# Altium project IPM Circuit.PrjPcb
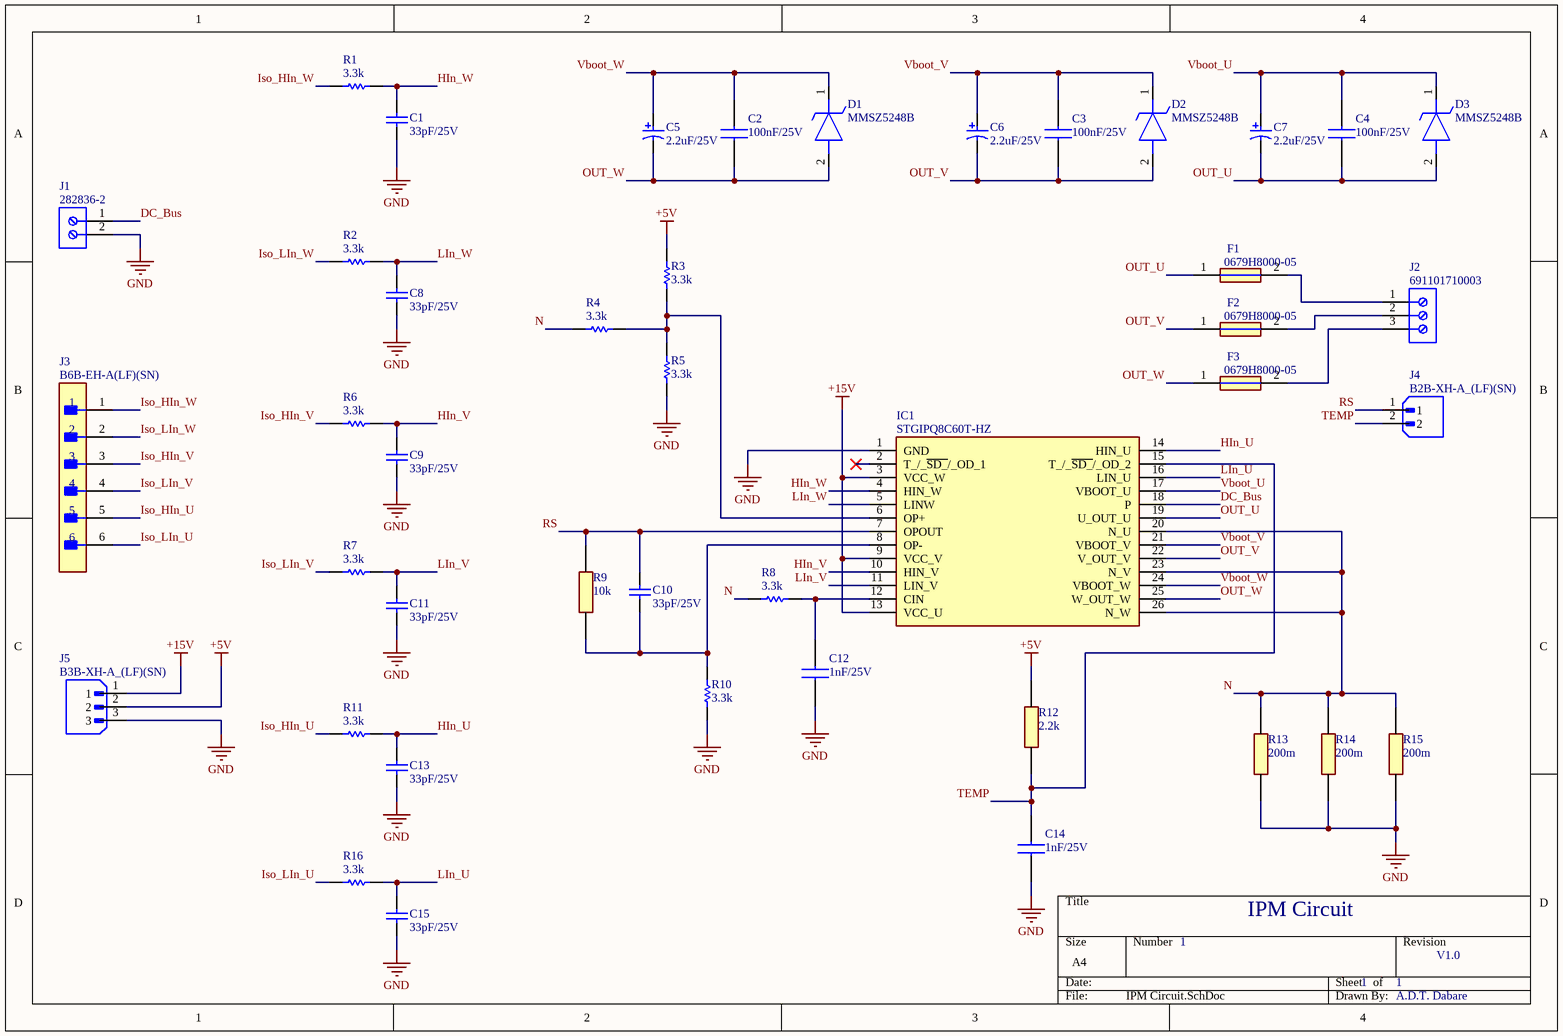
[diagram p0: IPM Circuit.SchDoc]
1 sheet, 43 parts. Net scope: global (net labels, ports and power ports of the same name join across sheets).
Board file: IPM Circuit.PcbDoc

## Sheet IPM Circuit.SchDoc
size A4; SheetNumber: 1; SheetTotal: 1

### Parts
C1  33pF/25V  [CAPC1210(3225)100_N]
C2  100nF/25V  [CAPC3225X105N]
C3  100nF/25V  [CAPC3225X105N]
C4  100nF/25V  [CAPC3225X105N]
C5  2.2uF/25V  [CAPPR55-200-1100X500X1200]
C6  2.2uF/25V  [CAPPR55-200-1100X500X1200]
C7  2.2uF/25V  [CAPPR55-200-1100X500X1200]
C8  33pF/25V  [CAPC1210(3225)100_N]
C9  33pF/25V  [CAPC1210(3225)100_N]
C10  33pF/25V  [CAPC1210(3225)100_N]
C11  33pF/25V  [CAPC1210(3225)100_N]
C12  1nF/25V  [CAPC3225X105N]
C13  33pF/25V  [CAPC1210(3225)100_N]
C14  1nF/25V  [CAPC3225X105N]
C15  33pF/25V  [CAPC1210(3225)100_N]
D1  MMSZ5248B  [SOD3816X135N]
D2  MMSZ5248B  [SOD3816X135N]
D3  MMSZ5248B  [SOD3816X135N]
F1  0679H8000-05  [FUSC6125X279N]
F2  0679H8000-05  [FUSC6125X279N]
F3  0679H8000-05  [FUSC6125X279N]
IC1  STGIPQ8C60T-HZ  [STGIPQ5C60THZS]
J1  282836-2  [TECO-282836-2_V]
J2  691101710003  [691101710003]
J3  B6B-EH-A(LF)(SN)  [FP-B6B-EH-A_LF_SN-MFG]
J4  B2B-XH-A_(LF)(SN)  [JST_B2B-XH-A_(LF)(SN)]
J5  B3B-XH-A_(LF)(SN)  [JST_B3B-XH-A (LF)(SN)]
R1  3.3k  [RESC3225X70X50NL20T20]
R2  3.3k  [RESC3225X70X50NL20T20]
R3  3.3k  [RESC3225X70X50NL20T20]
R4  3.3k  [RESC3225X70X50NL20T20]
R5  3.3k  [RESC3225X70X50NL20T20]
R6  3.3k  [RESC3225X70X50NL20T20]
R7  3.3k  [RESC3225X70X50NL20T20]
R8  3.3k  [RESC3225X70X50NL20T20]
R9  10k  [ERJ14BQF1R0U]
R10  3.3k  [RESC3225X70X50NL20T20]
R11  3.3k  [RESC3225X70X50NL20T20]
R12  2.2k  [RESC3225X60N]
R13  200m  [RESC6432X90N]
R14  200m  [RESC6432X90N]
R15  200m  [RESC6432X90N]
R16  3.3k  [RESC3225X70X50NL20T20]

### Nets
+5V: J5.2 R3.1 R12.2
+15V: IC1.3(VCC_W) IC1.9(VCC_V) IC1.13(VCC_U) J5.1
GND: C1.2 C8.2 C9.2 C11.2 C12.1 C13.2 C14.1 C15.2 IC1.1(GND) J1.2 J5.3 R5.2 R10.2 R13.1 R14.1 R15.1
DC_Bus: IC1.18(P) J1.1
HIn_U: C13.1 IC1.14(HIN_U) R11.1
HIn_V: C9.1 IC1.10(HIN_V) R6.1
HIn_W: C1.1 IC1.4(HIN_W) R1.1
Iso_HIn_U: J3.5 R11.2
Iso_HIn_V: J3.3 R6.2
Iso_HIn_W: J3.1 R1.2
Iso_LIn_U: J3.6 R16.2
Iso_LIn_V: J3.4 R7.2
Iso_LIn_W: J3.2 R2.2
LIn_U: C15.1 IC1.16(LIN_U) R16.1
LIn_V: C11.1 IC1.11(LIN_V) R7.1
LIn_W: C8.1 IC1.5(LINW) R2.1
N: IC1.20(N_U) IC1.23(N_V) IC1.26(N_W) R4.2 R8.2 R13.2 R14.2 R15.2
OUT_U: C4.1 C7.2 D3.2(A) F1.1 IC1.19(U_OUT_U)
OUT_V: C3.1 C6.2 D2.2(A) F2.1 IC1.22(V_OUT_V)
OUT_W: C2.1 C5.2 D1.2(A) F3.1 IC1.25(W_OUT_W)
RS: C10.1 IC1.7(OPOUT) J4.1 R9.2
TEMP: C14.2 IC1.15(T_/_~{SD_}/_OD_2) J4.2 R12.1
Vboot_U: C4.2 C7.1 D3.1(K) IC1.17(VBOOT_U)
Vboot_V: C3.2 C6.1 D2.1(K) IC1.21(VBOOT_V)
Vboot_W: C2.2 C5.1 D1.1(K) IC1.24(VBOOT_W)
NetC10_2: C10.2 IC1.8(OP-) R9.1 R10.1
NetC12_2: C12.2 IC1.12(CIN) R8.1
NetF1_2: F1.2 J2.1
NetF2_2: F2.2 J2.2
NetF3_2: F3.2 J2.3
NetIC1_6: IC1.6(OP+) R3.2 R4.1 R5.1

Not connected (* = marked no-connect by the designer): IC1 2(T_/_~{SD_}/_OD_1)*

### Notes on the sheet
- IPM Circuit
- 1
- V1.0
- A.D.T. Dabare

### Library data of the parts
C1 C8-C11 C13 C15 = CMP-1038-00096-1: CAP 33pF 50V ±5% 1210 (3225 Metric) Thickness 1mm SMD; Case-Metric: 3225; Case-EIA: 1210; Tolerance: Â±5%; Max Thickness: 1 mm; Value: 33pF; Technology: SMT; Rated Voltage: 50 V
C2 = 885012209015: 100nF 25V 1210 SMDCapacitor; Manufacturer_Name: Wurth Elektronik; Datasheet Link: https://katalog.we-online.com/pbs/datasheet/885012209015.pdf; Height: 1.05mm; Manufacturer_Part_Number: 885012209015; Mouser Part Number: 710-885012209015; Mouser Price/Stock: https://www.mouser.co.uk/ProductDetail/Wurth-Elektronik/885012209015?qs=0KOYDY2FL2%252BsVC1aam9vyA%3D%3D
C3 C4 C12 C14 = 885012209015: 1nF 25V 1210 SMDCapacitor; Manufacturer_Name: Wurth Elektronik; Datasheet Link: https://katalog.we-online.com/pbs/datasheet/885012209015.pdf; Height: 1.05mm; Manufacturer_Part_Number: 885012209015; Mouser Part Number: 710-885012209015; Mouser Price/Stock: https://www.mouser.co.uk/ProductDetail/Wurth-Elektronik/885012209015?qs=0KOYDY2FL2%252BsVC1aam9vyA%3D%3D
C5-C7 = CMP-1665-00040-2: Aluminum Electrolytic Capacitor, 2.2 uF, +/- 20%, 50 V, -40 to 85 degC, 2-Pin THD, RoHS, Bulk; Manufacturer: Panasonic; Voltage: 50V; Dielectric Material: Aluminium; Ripple Current: 20mA; Leakage Current: 3uA; Life (Hours): 2000Hour; Lead/Base Style: Straight; Dissipation Factor: 0.12%; Lead Diameter: 0.5mm; Capacitance: 2.2uF; Number of Pins: 2; Manufacturer URL: http://www.panasonic.com/; Contact Plating: Tin; Datasheet Version: Rev. 05, 10/2016; RoHSCompliant: true; Height - Seated (Max): 0.472inch; Height: 11mm; Length: 11mm; Termination: Radial; Packaging: Bulk; Case/Package: Radial; Voltage Rating (DC): 50V; Package Quantity: 200; Datasheet URL: https://industrial.panasonic.com/cdbs/www-data/pdf/RDF0000/ABA0000C1218.pdf; Radiation Hardening: No; REACH SVHC: NoSVHC; Max Operating Temperature: 85degC; Voltage Rating: 50V; Mount: ThroughHole; Diameter: 5mm; Lead Pitch: 2mm; Tolerance: 20%; Package Reference: CAPPR55-200-1100X500X1200; Lead Free: LeadFree; Package Description: 2-Pin Radial Lead, Dia 5 mm, Height 12 mm; Min Operating Temperature: -40degC
D1-D3 = MMSZ5248B_R1_00001: Diode; Manufacturer_Name: PANJIT; Datasheet Link: https://www.mouser.in/datasheet/2/1057/MMSZ5221B_SERIES-1865969.pdf; Height: 1.35mm; Manufacturer_Part_Number: MMSZ5248B_R1_00001; Mouser Part Number: 241-MMSZ5248BR100001; Mouser Price/Stock: https://www.mouser.co.uk/ProductDetail/Panjit/MMSZ5248B_R1_00001?qs=sPbYRqrBIVm8lknYNYa9yQ%3D%3D
F1-F3 = 0679H8000-05: Fuse; Manufacturer_Name: Bel Circuit Protection; Datasheet Link: https://www.mouser.ec/datasheet/2/643/ds_cp_0679h_series-1290853.pdf; Height: 2.79mm; Manufacturer_Part_Number: 0679H8000-05; Arrow Part Number: 0679H8000-05; Arrow Price/Stock: https://www.arrow.com/en/products/0679h8000-05/bel-group?region=nac
IC1 = STGIPQ8C60T-HZ: Integrated Circuit; Manufacturer_Name: STMicroelectronics; Datasheet Link: https://www.st.com/resource/en/datasheet/stgipq8c60t-hz.pdf; Height: 5mm; Manufacturer_Part_Number: STGIPQ8C60T-HZ; Mouser Part Number: 511-STGIPQ8C60T-HZ; Mouser Price/Stock: https://www.mouser.co.uk/ProductDetail/STMicroelectronics/STGIPQ8C60T-HZ?qs=NoqMqJKvPFK9ZD4jsoLk8w%3D%3D; Arrow Part Number: STGIPQ8C60T-HZ; Arrow Price/Stock: https://www.arrow.com/en/products/stgipq8c60t-hz/stmicroelectronics?region=nac
J1 = CMP-1684-00017-1: Female Header, Pitch 5 mm, 1 x 2 Position, Height 10 mm, Tail Length 3.5 mm, Rohs, Bulk; Manufacturer: TE Connectivity; Wire Gauge: 16-30AWG; Product Training Modules: Wire-to-BoardEurostyleTerminalBlocks; Clamp Material - Plating: Brass-NickelPlated; Voltage: 300V; Mating Orientation: HorizontalwithBoard; Current: 13.5A; Pitch: 0.197"(5.00mm); Screw Thread: M3; 3D Model: 282836-2.pdf; Other Names: 5ULV-02B / A98076; Dynamic Catalog: BuchananSeries; Number of Levels: 1; Torque - Screw: 0.68Nm(6Lb-In); Featured Product: EurostyleTerminalBlockConnectors; Positions Per Level: 2; Wire Termination: Screw-RisingCageClamp; Datasheet URL: http://www.te.com.cn/commerce/DocumentDelivery/DDEController?Action=showdoc&DocId=Catalog+Section%7F1308389_EUROSTYLE_TERMINAL_BLOCKS%7F0607%7Fpdf%7FEnglish%7FENG_CS_1308389_EUROSTYLE_TERMINAL_BLOCKS_0607.pdf%7F282836-2; Color: Green; Family: TerminalBlocks-WiretoBoard; RoHS Information: 282836-2StatementofCompliance; Standard Package: 300; Contact Material - Plating: Brass-TinPlated; Manufacturer URL: http://www.te.com; Housing Material: Polyamide(PA66),Nylon6/6; Features: Interlocking(Side); Package Description: Female Header, Pitch 5 mm, 1 x 2 Position, Height 10 mm, Tail Length 3.5 mm; Mounting Type: ThroughHole; Package Reference: THD; Packaging: Bulk; Series: Buchanan; Category: Connectors,Interconnects; Screw Material - Plating: Brass-NickelPlated
J2 = CMP-1502-03257-2: NexarPartId: 8917705; Voltage Rating: 250V; Current: 16A; Wire Gauge (Min): 14AWG; Pitch: 5.0038mm; Wire Gauge (Max): 26AWG; Number of Positions Per Level: 3; Plating: Steel; Number of Levels: 1; Stripping Length: -7mm; REACH SVHC: Unknown; Width: 16.2mm; Height: 16.4mm; Contact Material: Brass; RoHS: Compliant; Color: Blue; Contact Plating: Tin; Lead Pitch: 5mm; Packaging: Box; Termination: Screw; Number of Contacts: 3; Wire/Cable Gauge: 26AWG; Min Operating Temperature: -40°C; Max Operating Temperature: 105°C; Housing Material: Nylon; Length: 9mm; Voltage: 250V; Mount: Through Hole; Current Rating: 16A; Number of Pins: 3
J3 = CMP-17439-000293-1: CONN HEADER VERT 6POS 2.5MM; Voltage Rating: 250V; Number of Positions: 6; Current Rating: 3A; Mated Stacking Heights: 8.1mm; Gender: Male; Insulation Material: Nylon; Number of Contacts: 6; Contact Plating: Tin; Pitch: 2.5mm; Orientation: Straight; Insulation Color: Natural; Packaging: Bulk; Termination: Solder; Flammability Rating: UL94 V-0; Lead Free: Lead Free; Contact Mating Length: 0.13inch; Color: Natural; Contact Finish - Mating: TIN; Connector Type: Header; Contact Shape: Square; Contact Type: Male Pin; Series: EH; Contact Material: Brass; Fastening Type: Friction; Number of Rows: 1; Mount: Through Hole; Housing Color: White
J4 = B2B-XH-A_(LF)(SN): Connector Header Through Hole 2 position 0.098 (2.50mm); MF: JST Sales; MP: B2B-XH-A (LF)(SN); SnapEDA_Link: https://www.snapeda.com/parts/B2B-XH-A%20(LF)(SN)/JST+Sales+America+Inc./view-part/?ref=snap; Package: None; Value: *; Check_prices: https://www.snapeda.com/parts/B2B-XH-A%20(LF)(SN)/JST+Sales+America+Inc./view-part/?ref=eda
J5 = B3B-XH-A_(LF)(SN): Connector Header Through Hole 3 position 0.098 (2.50mm); MF: JST Sales America Inc.; MP: B3B-XH-A (LF)(SN); SnapEDA_Link: https://www.snapeda.com/parts/B3B-XH-A%20(LF)(SN)/JST+Sales+America+Inc./view-part/?ref=snap; Package: None; Value: *; Check_prices: https://www.snapeda.com/parts/B3B-XH-A%20(LF)(SN)/JST+Sales+America+Inc./view-part/?ref=eda
R1-R8 R10 R11 R16 = CMP-2005-03838-2: 3.3k 0.5W 1210 SMD Resistor; Part Number: ERJ-L14KF10CU; Manufacturer: Panasonic
R9 = ERJ-14NF1002U: 10k 0.5W 1210 SMD Resistor; Manufacturer_Name: Panasonic; Datasheet Link: https://industrial.panasonic.com/cdbs/www-data/pdf/RDA0000/AOA0000C84.pdf; Height: 0.7mm; Manufacturer_Part_Number: ERJ-14NF1002U; Mouser Part Number: 667-ERJ-14NF1002U; Mouser Price/Stock: https://www.mouser.co.uk/ProductDetail/Panasonic/ERJ-14NF1002U?qs=DQ1bOpn7xPCpWa2jtZ42Rg%3D%3D; Arrow Part Number: ERJ-14NF1002U; Arrow Price/Stock: https://www.arrow.com/en/products/erj-14nf1002u/panasonic?region=nac
R12 = CRCW12102K20JNEA: 2.2k 0.5W 1210 SMD Resistor; Manufacturer_Name: Vishay; Datasheet Link: http://componentsearchengine.com/Datasheets/1/CRCW12102K20JNEA.pdf; Height: 0.6mm; Manufacturer_Part_Number: CRCW12102K20JNEA; Mouser Part Number: 71-CRCW1210J-2.2K-E3; Mouser Price/Stock: https://www.mouser.co.uk/ProductDetail/Vishay-Dale/CRCW12102K20JNEA?qs=u0pLYIWDdLe6Vz%252BoOoKxpA%3D%3D
R13-R15 = TLRP3A30CR200FTE: 0.2Ohm 3W 2512 SMD Resistor; Manufacturer_Name: TE Connectivity; Datasheet Link: https://www.te.com/commerce/DocumentDelivery/DDEController?Action=srchrtrv&DocNm=1773449-4&DocType=Data%20Sheet&DocLang=English&PartCntxt=4-2176422-6&DocFormat=pdf; Height: 0.9mm; Manufacturer_Part_Number: TLRP3A30CR200FTE; Mouser Part Number: 279-TLRP3A30CR200FTE; Mouser Price/Stock: https://www.mouser.co.uk/ProductDetail/TE-Connectivity-Holsworthy/TLRP3A30CR200FTE?qs=QNEnbhJQKvbU4hSlZCsDtQ%3D%3D; Arrow Part Number: TLRP3A30CR200FTE; Arrow Price/Stock: https://www.arrow.com/en/products/tlrp3a30cr200fte/te-connectivity?region=nac